# EAGLE design VehicleDriverSchematics2 (EAGLE 9.6.2)
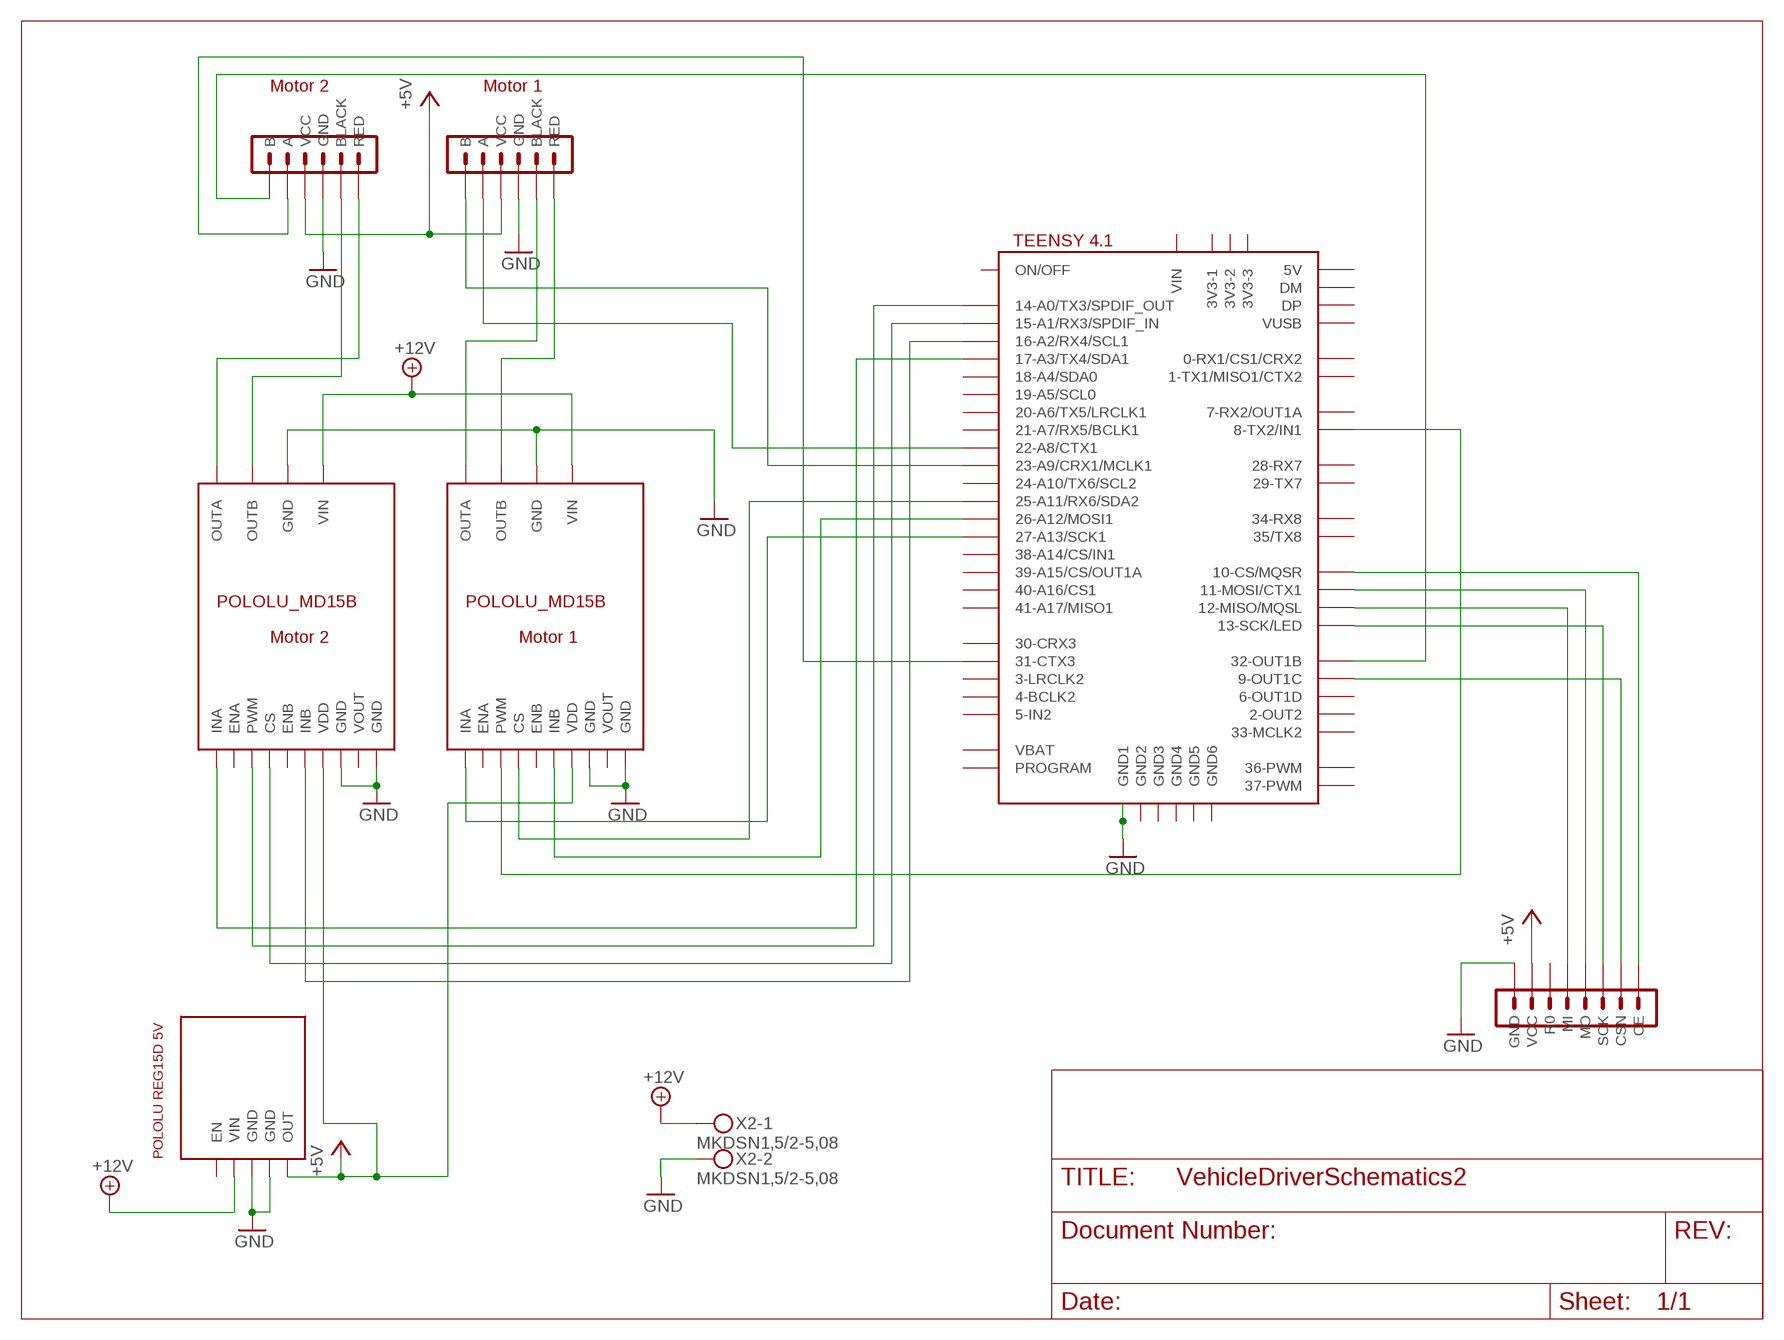
[diagram p0: schematic, sheet 1]

## Parts
U$2  POLOLU_MD15B  [POLOLU_MD15B]
U$3  POLOLU_MD15B  [POLOLU_MD15B]
U$4  TEENSY41-E  [TENNSY41-E]
U$5  MA06-1  [MA06-1]
U$6  MA06-1  [MA06-1]
U$7  MA08-1-RF24  [MA08-1-RF24]
U$8  POLOLU_REG15D  [POLOLU_REG15D]
X2  MKDSN1,5/2-5,08  [MKDSN1,5/2-5,08]

## Nets
+5V: U$2.VDD U$3.VDD U$5.VCC U$6.VCC U$7.VCC U$8.OUT
+12V: U$2.VIN U$3.VIN U$8.VIN X2.1
GND: U$2.GND U$2.GND@1(GND) U$2.GND@2(GND) U$3.GND U$3.GND@1(GND) U$3.GND@2(GND) U$4.GND1 U$5.GND U$6.GND U$7.GND U$8.GND U$8.GND@1(GND) X2.2
N$1: U$3.OUTB U$6.RED
N$2: U$3.OUTA U$6.BLACK
N$3: U$2.OUTA U$5.RED
N$4: U$2.OUTB U$5.BLACK
N$5: U$4.23-A9/CRX1/MCLK1 U$6.B
N$6: U$4.22-A8/CTX1 U$6.A
N$7: U$4.32-OUT1B U$5.B
N$8: U$4.31-CTX3 U$5.A
N$9: U$3.INA U$4.27-A13/SCK1
N$10: U$3.PWM U$4.8-TX2/IN1
N$11: U$3.CS U$4.25-A11/RX6/SDA2
N$12: U$3.INB U$4.26-A12/MOSI1
N$13: U$2.INA U$4.17-A3/TX4/SDA1
N$14: U$2.PWM U$4.14-A0/TX3/SPDIF_OUT
N$15: U$2.CS U$4.15-A1/RX3/SPDIF_IN
N$16: U$2.INB U$4.16-A2/RX4/SCL1
N$17: U$4.12-MISO/MQSL U$7.MI
N$18: U$4.11-MOSI/CTX1 U$7.MO
N$19: U$4.13-SCK/LED U$7.SCK
N$20: U$4.10-CS\MQSR(10-CS/MQSR) U$7.CE
N$21: U$4.9-OUT1C U$7.CSN
Unconnected: U$2.ENA U$2.ENB U$2.VOUT U$3.ENA U$3.ENB U$3.VOUT U$4.0-RX1/CS1/CRX2 U$4.1-TX1/MISO1/CTX2 U$4.2-OUT2 U$4.3-LRCLK2 U$4.3V3-1 U$4.3V3-2 U$4.3V3-3 U$4.4-BCLK2 U$4.5-IN2 U$4.6-OUT1D U$4.7-RX2/OUT1A U$4.18-A4/SDA0 U$4.19-A5/SCL0 U$4.20-A6/TX5/LRCLK1 U$4.21-A7/RX5/BCLK1 U$4.24-A10/TX6/SCL2 U$4.28-RX7 U$4.29-TX7 U$4.30-CRX3 U$4.33-MCLK2 U$4.34-RX8 U$4.35-TX8(35/TX8) U$4.36-PWM U$4.37-PWM U$4.38-A14/CS/IN1 U$4.39-A15/CS/OUT1A U$4.40-A16/CS1 U$4.41-A17/MISO1 U$4.+5V(5V) U$4.DM U$4.DP U$4.GND2 U$4.GND3 U$4.GND4 U$4.GND5 U$4.GND6 U$4.ON/OFF U$4.PROGRAM U$4.VBAT U$4.VIN U$4.VUSB U$7.R0 U$8.EN

## Notes on the sheet
- Motor 2 | Motor 1
- Motor 2 | Motor 1

## Library data of the parts
U$2 U$3 = VehicleDriverParts:POLOLU_MD15B
U$4 = teensy:TEENSY41-E
U$5 U$6 = VehicleDriverParts:MA06-1
U$7 = VehicleDriverParts:MA08-1-RF24
U$8 = VehicleDriverParts:POLOLU_REG15D
X2 = con-phoenix-508:MKDSN1,5/2-5,08: MKDSN 1,5/ 2-5,08 Printklemme Nennstrom: 13,5 A Nennspannung: 250 V Rastermaß: 5,08 mm Polzahl: 2 Anschlussart: Schraubanschluss Montage: Löten Anschlussrichtung Leiter/Platine: 0 ° Artikelnummer: 1729128 Source: http://eshop.phoenixcontact.com .. 1729128.pdf

## Board
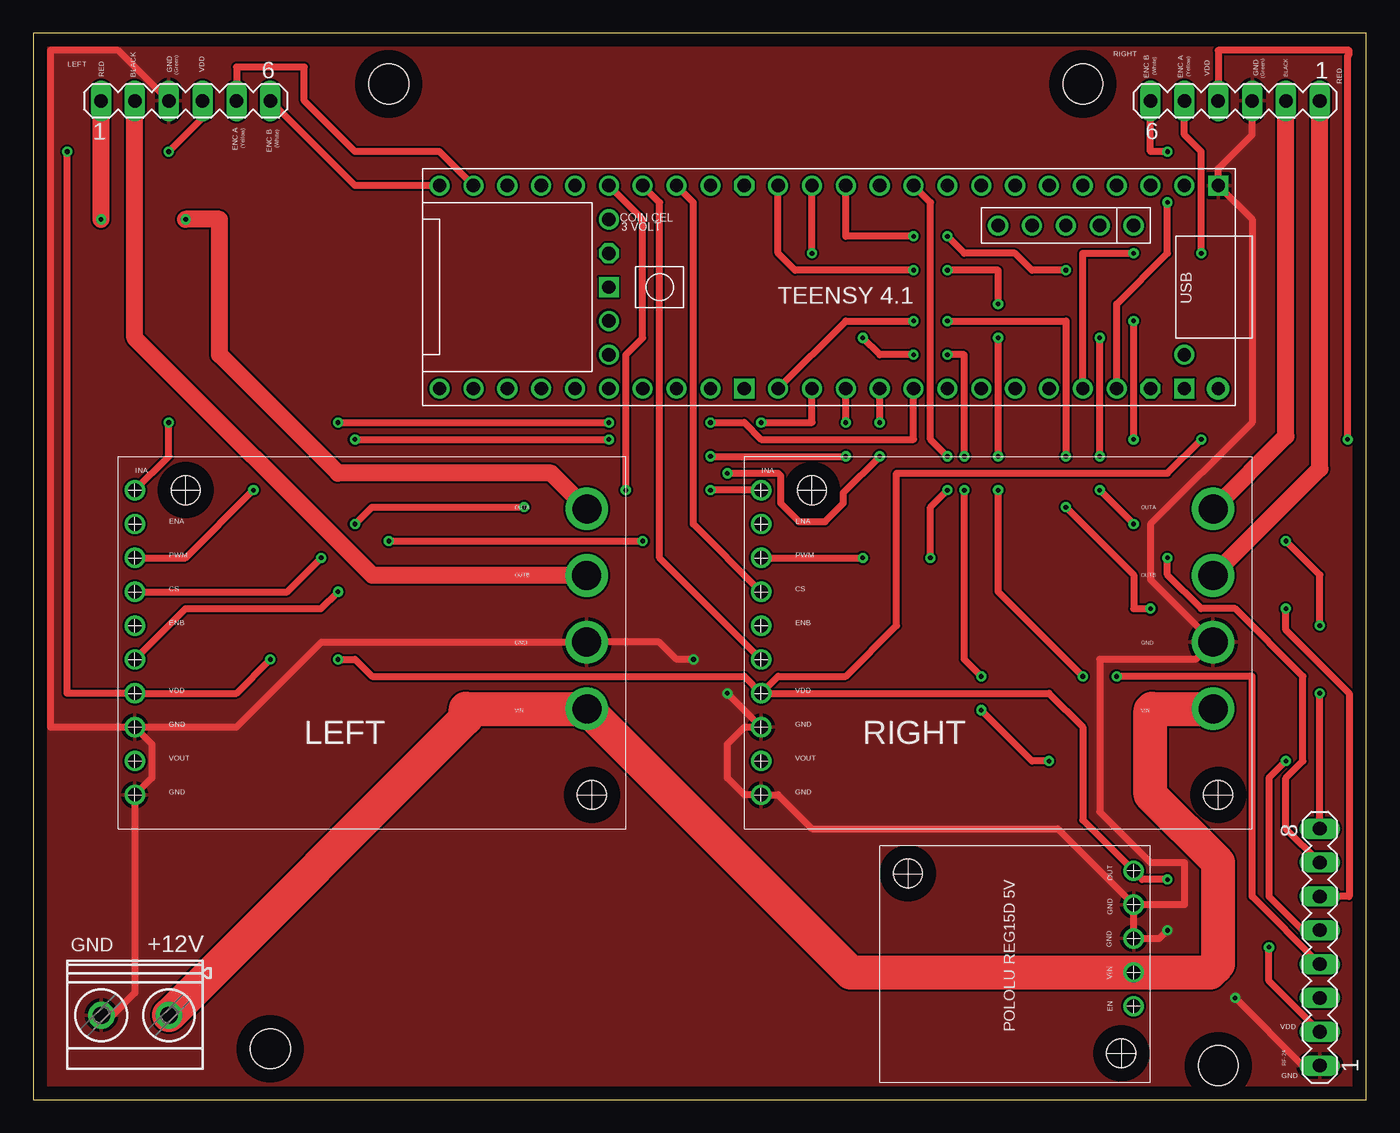
[diagram p1: board, top side]
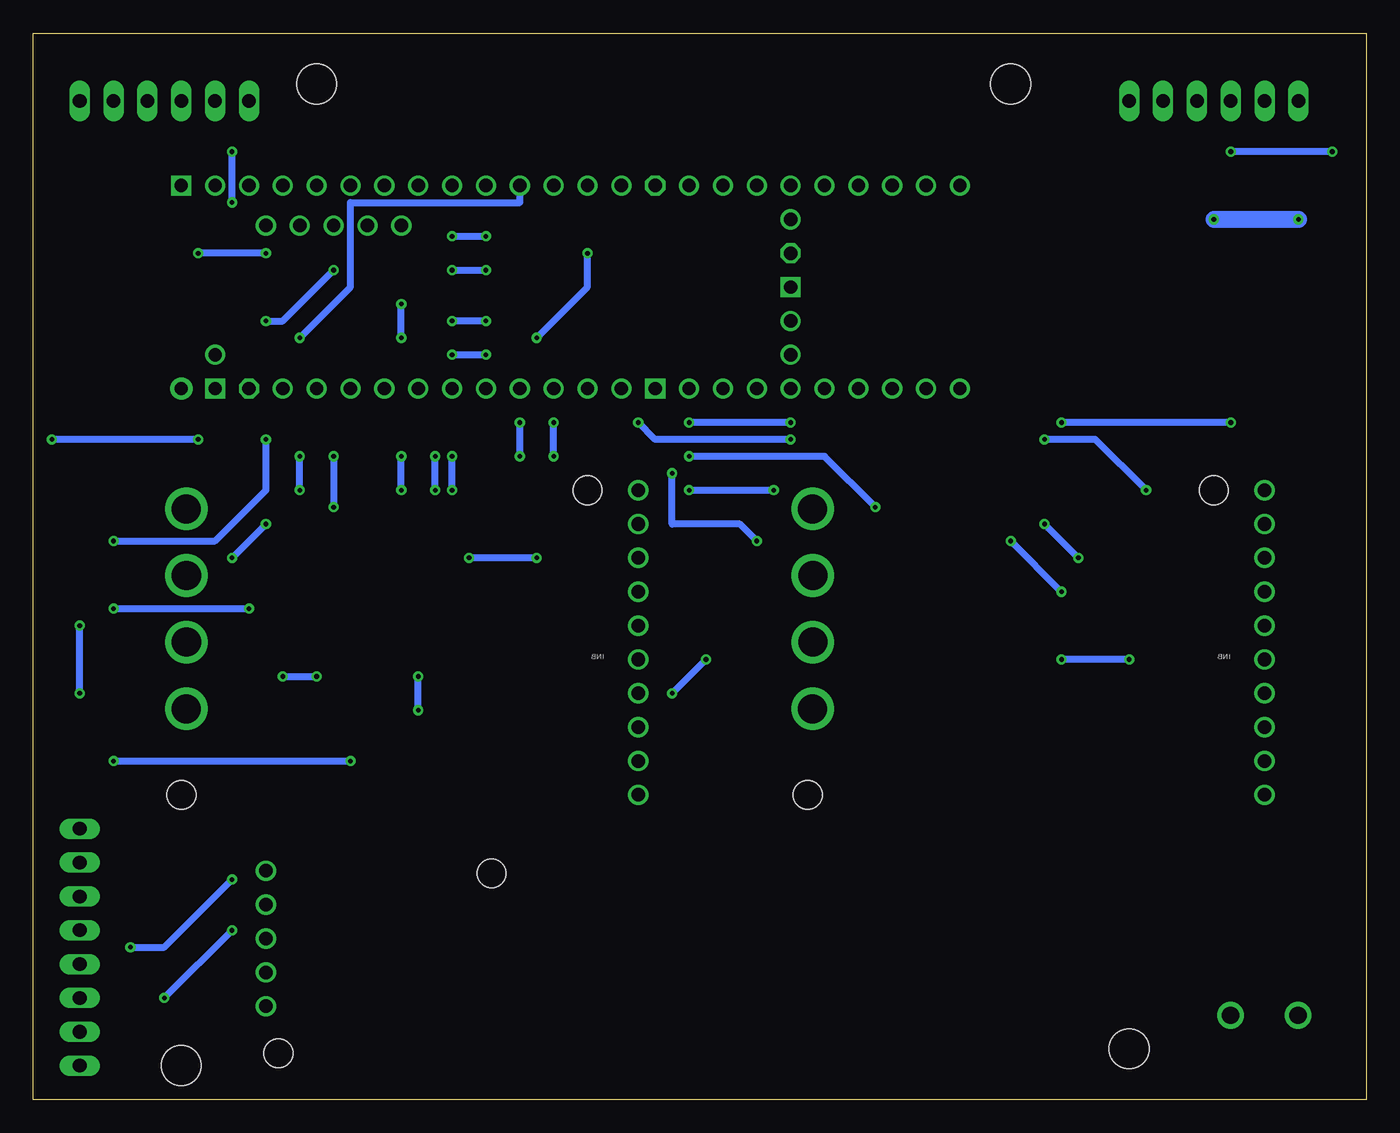
[diagram p2: board, bottom side, seen from below]

Size 100 x 80 mm. Coordinates in mm from the lower left corner, seen from the top.
Outline: 0,0 100,0 100,80 0,80 0,0
Copper layers (1*16): Top 0.035mm / dielectric 1.5mm / Bottom 0.035mm
Design rules "default": minimum track width 6mil, minimum drill 0.35mm, track to track 6mil, track to pad 6mil, pad to pad 6mil, via to via 6mil, smd to smd 6mil, copper to edge 40mil, drill to drill 6mil, minimum pad ring 10mil, minimum via ring 8mil, stop-mask expansion 4mil, vias tented up to drill 0mil, thermal gap 10mil
Holes 3 mm at 26.67,76.2 78.74,76.2 17.78,3.81 88.9,2.54

### Footprints (pad centres in the part's own frame; a part is rotated, then mirrored left to right if it is on the bottom)
POLOLU_MD15B = drill 1.016: CS 1.27,17.78; ENA 1.27,22.86; ENB 1.27,15.24; GND 1.27,7.62; GND@1 1.27,2.54; INA 1.27,25.4; INB 1.27,12.7; PWM 1.27,20.32; VDD 1.27,10.16; VOUT 1.27,5.08 | drill 2.18: GND@2 35.17,14; OUTA 35.18,24; OUTB 35.17,19; VIN 35.18,9 | hole 2.18: 5.08,25.4; 35.56,2.54
TENNSY41-E = drill 1: 0-RX1/CS1/CRX2 -27.94,-7.62; 1-TX1/MISO1/CTX2 -25.4,-7.62; 2-OUT2 -22.86,-7.62; 3-LRCLK2 -20.32,-7.62; 4-BCLK2 -17.78,-7.62; 5-IN2 -15.24,-7.62; 6-OUT1D -12.7,-7.62; 7-RX2/OUT1A -10.16,-7.62; 8-TX2/IN1 -7.62,-7.62; 9-OUT1C -5.08,-7.62; 10-CS\MQSR -2.54,-7.62; 11-MOSI/CTX1 0,-7.62; 12-MISO/MQSL 2.54,-7.62; 13-SCK/LED 2.54,7.62; 14-A0/TX3/SPDIF_OUT 0,7.62; 15-A1/RX3/SPDIF_IN -2.54,7.62; 16-A2/RX4/SCL1 -5.08,7.62; 17-A3/TX4/SDA1 -7.62,7.62; 18-A4/SDA0 -10.16,7.62; 19-A5/SCL0 -12.7,7.62; 20-A6/TX5/LRCLK1 -15.24,7.62; 21-A7/RX5/BCLK1 -17.78,7.62; 22-A8/CTX1 -20.32,7.62; 23-A9/CRX1/MCLK1 -22.86,7.62; 24-A10/TX6/SCL2 7.62,-7.62; 25-A11/RX6/SDA2 10.16,-7.62; 26-A12/MOSI1 12.7,-7.62; 27-A13/SCK1 15.24,-7.62; 28-RX7 17.78,-7.62; 29-TX7 20.32,-7.62; 30-CRX3 22.86,-7.62; 31-CTX3 25.4,-7.62; 32-OUT1B 27.94,-7.62; 33-MCLK2 27.94,7.62; 34-RX8 25.4,7.62; 35-TX8 22.86,7.62; 36-PWM 20.32,7.62; 37-PWM 17.78,7.62; 38-A14/CS/IN1 15.24,7.62; 39-A15/CS/OUT1A 12.7,7.62; 40-A16/CS1 10.16,7.62; 41-A17/MISO1 7.62,7.62; +5V -24.13,-4.62; DM -21.59,-4.62; DP -19.05,-4.62; GND4 -16.51,-4.62; GND5 -13.97,-4.62; ON/OFF 15.24,5.08; PROGRAM 15.24,2.54; VBAT 15.24,-5.08; VUSB -27.94,5.08 | drill 1 octagon: 3V3-1 5.08,-7.62; 3V3-2 15.24,-2.54; 3V3-3 -25.4,7.62 | drill 1 square: GND1 -30.48,-7.62; GND2 15.24,0; GND3 5.08,7.62; GND6 -27.94,7.62 | drill 1 pad 1.676: VIN -30.48,7.62
MA06-1 = drill 1.016 long: A 3.81,0; B 6.35,0; BLACK -3.81,0; GND -1.27,0; RED -6.35,0; VCC 1.27,0
MA08-1-RF24 = drill 1.016 long: CE 8.89,0; CSN 6.35,0; GND -8.89,0; MI -1.27,0; MO 1.27,0; R0 -3.81,0; SCK 3.81,0; VCC -6.35,0
POLOLU_REG15D = drill 1.016: EN 5.73,1.27; GND 13.35,1.27; GND@1 10.81,1.27; OUT 15.89,1.27; VIN 8.27,1.27 | hole 2.18: 2.2,2.2; 15.7,18.2
MKDSN1,5/2-5,08 = drill 1.3 pad 2: 1 -2.561,0.025; 2 2.519,0.025

### Placement (x,y rotation side)
U$2  6.35,20.32 0 top
U$3  53.34,20.32 0 top
U$4  58.42,60.96 180 top
U$5  11.43,74.93 0 top
U$6  90.17,74.93 180 top
U$7  96.52,11.43 90 top
U$8  83.82,1.27 90 top
X2  7.62,6.35 180 top

### Tracks (layer width: path | path; a pad name or v marks a point on that pad's centre or on a via)
+5V  (via drill 0.35)
  Top 0.508: v2.54,71.12 2.54,30.48 U$2.VDD 15.24,30.48 v17.78,33.02 | v10.16,71.12 12.7,73.66 U$5.VCC | v22.86,33.02 24.13,33.02 25.4,31.75 53.34,31.75 U$3.VDD | U$3.VDD 76.2,30.48 78.74,27.94 78.74,20.97 U$8.OUT 83.2,16.51 v85.09,16.51 | U$3.VDD 55.88,31.75 60.96,31.75 64.77,35.56 64.77,46.99 85.09,46.99 v87.63,49.53 | v98.61,49.53 98.61,78.29 98.73,78.41 98.73,78.73 88.9,78.73 U$6.VCC | U$7.VCC 92.71,8.89 v92.71,11.43
  Bottom 0.508: v2.54,71.12 v10.16,71.12 | v17.78,33.02 v22.86,33.02 | v87.63,49.53 v98.61,49.53 | v92.71,11.43 90.17,11.43 v85.09,16.51
+12V
  Top 2.54: U$3.VIN 83.93,29.32 83.82,29.21 83.82,22.86 88.9,17.78 88.9,10.16 88.28,9.54 U$8.VIN 61.31,9.54 U$2.VIN 32.44,29.32 32.44,28.58 X2.1
GND  (via drill 0.35)
  Top 0.508: U$5.GND 6.36,78.73 1.27,78.73 1.27,27.94 U$2.GND | U$8.GND U$8.GND@1 84.47,12.08 v85.09,12.7 | v90.17,7.62 95.25,2.54 U$7.GND | U$2.GND 8.89,26.67 8.89,24.13 U$2.GND@1 7.62,11.43 7.62,8 5.95,6.33 X2.2 | U$2.GND 15.24,27.94 21.62,34.32 U$2.GND@2 46.96,34.32 48.26,33.02 v49.53,33.02 | U$8.GND 76.85,20.32 58.42,20.32 55.88,22.86 U$3.GND@1 53.34,22.86 52.07,24.13 52.07,26.67 53.34,27.94 U$3.GND v52.07,30.48 | U$6.GND 91.44,72.39 88.9,69.85 U$4.GND1 91.44,66.04 91.44,50.8 83.82,43.18 83.82,39.01 U$3.GND@2 87.21,33.02 80.01,33.02 80.01,21.59 83.82,17.78 86.36,17.78 86.36,14.62 U$8.GND
  Bottom 0.508: v85.09,12.7 v90.17,7.62 | v52.07,30.48 v49.53,33.02
  pour Top: 0,80 0,0 100,0 100,80
N$1
  Top 1.27: U$3.OUTB 96.52,47.33 U$6.RED
N$2
  Top 1.27: U$3.OUTA 93.98,49.78 U$6.BLACK
N$3  (via drill 0.35)
  Top 1.27: U$2.OUTA 38.86,46.99 22.86,46.99 13.97,55.88 13.97,66.04 v11.43,66.04 | v5.08,66.04 U$5.RED
  Bottom 1.27: v11.43,66.04 v5.08,66.04
N$4
  Top 1.27: U$2.OUTB 25.45,39.32 7.62,57.15 U$5.BLACK
N$5  (via drill 0.35)
  Top 0.508: U$4.23-A9/CRX1/MCLK1 81.28,59.69 85.09,63.5 v85.09,67.31 | v85.09,71.12 83.82,71.12 U$6.B
  Bottom 0.508: v85.09,67.31 v85.09,71.12
N$6  (via drill 0.35)
  Top 0.508: U$4.22-A8/CTX1 78.74,63.5 v82.55,63.5 | v87.63,63.5 87.63,71.12 86.36,72.39 U$6.A
  Bottom 0.508: v82.55,63.5 v87.63,63.5
N$7
  Top 0.508: U$4.32-OUT1B 24.13,68.58 U$5.B
N$8
  Top 0.508: U$4.31-CTX3 30.48,71.12 24.13,71.12 20.32,74.93 20.32,77.47 15.24,77.47 U$5.A
N$9  (via drill 0.35)
  Top 0.508: U$3.INA v50.8,45.72 | v44.45,45.72 44.45,55.88 45.72,57.15 45.72,66.04 U$4.27-A13/SCK1
  Bottom 0.508: v50.8,45.72 v44.45,45.72
N$10  (via drill 0.35)
  Top 0.508: U$3.PWM v62.23,40.64 | v67.31,40.64 67.31,44.45 v68.58,45.72 | v68.58,48.26 67.31,49.53 67.31,67.31 U$4.8-TX2/IN1
  Bottom 0.508: v62.23,40.64 v67.31,40.64 | v68.58,45.72 v68.58,48.26
N$11
  Top 0.508: U$3.CS 49.53,43.18 49.53,67.31 U$4.25-A11/RX6/SDA2
N$12
  Top 0.508: U$3.INB 46.99,40.64 46.99,67.31 U$4.26-A12/MOSI1
N$13  (via drill 0.35)
  Top 0.508: U$2.INA 10.16,48.26 v10.16,50.8 | v22.86,50.8 v43.18,50.8 | v50.8,50.8 53.34,50.8 54.61,49.53 66.04,49.53 U$4.17-A3/TX4/SDA1
  Bottom 0.508: v10.16,50.8 v22.86,50.8 | v43.18,50.8 v50.8,50.8
N$14  (via drill 0.35)
  Top 0.508: U$2.PWM 11.43,40.64 v16.51,45.72 | v24.13,49.53 v43.18,49.53 | v54.61,50.8 58.42,50.8 U$4.14-A0/TX3/SPDIF_OUT
  Bottom 0.508: v16.51,45.72 20.32,49.53 v24.13,49.53 | v54.61,50.8 53.34,49.53 v43.18,49.53
N$15  (via drill 0.35)
  Top 0.508: U$2.CS 19.05,38.1 v21.59,40.64 | v24.13,43.18 25.4,44.45 v36.83,44.45 | v50.8,48.26 v60.96,48.26 | v60.96,50.8 U$4.15-A1/RX3/SPDIF_IN
  Bottom 0.508: v21.59,40.64 v24.13,43.18 | v36.83,44.45 40.64,48.26 v50.8,48.26 | v60.96,48.26 v60.96,50.8
N$16  (via drill 0.35)
  Top 0.508: U$2.INB 11.43,36.83 21.59,36.83 v22.86,38.1 | v26.67,41.91 v45.72,41.91 | v52.07,46.99 55.88,46.99 56.06,46.81 56.06,44.74 57.44,43.36 59.4,43.36 60.78,44.74 60.78,45.54 v63.5,48.26 | v63.5,50.8 U$4.16-A2/RX4/SCL1
  Bottom 0.508: v22.86,38.1 v26.67,41.91 | v45.72,41.91 46.99,43.18 52.07,43.18 v52.07,46.99 | v63.5,48.26 v63.5,50.8
N$17  (via drill 0.35)
  Top 0.508: U$7.MI 91.44,15.24 91.44,31.75 v81.28,31.75 | v78.74,31.75 72.39,38.1 v72.39,45.72 | v72.39,48.26 v72.39,57.15 | v72.39,59.69 72.39,62.23 v68.58,62.23 | v66.04,62.23 57.15,62.23 55.88,63.5 U$4.12-MISO/MQSL
  Bottom 0.508: v81.28,31.75 v78.74,31.75 | v72.39,45.72 v72.39,48.26 | v72.39,57.15 v72.39,59.69 | v68.58,62.23 v66.04,62.23
N$18  (via drill 0.35)
  Top 0.508: U$7.MO 95.25,12.7 92.71,15.24 92.71,24.13 v93.98,25.4 | v76.2,25.4 74.93,25.4 v71.12,29.21 | v71.12,31.75 69.85,33.02 v69.85,45.72 | v69.85,48.26 69.85,55.88 v68.58,55.88 | v66.04,55.88 63.5,55.88 v62.23,57.15 | v58.42,63.5 U$4.11-MOSI/CTX1
  Bottom 0.508: v93.98,25.4 v76.2,25.4 | v71.12,29.21 v71.12,31.75 | v69.85,45.72 v69.85,48.26 | v68.58,55.88 v66.04,55.88 | v62.23,57.15 58.42,60.96 v58.42,63.5
N$19  (via drill 0.35)
  Top 0.508: U$4.13-SCK/LED 60.96,58.42 v66.04,58.42 | v68.58,58.42 77.47,58.42 v77.47,48.26 | v77.47,44.45 82.55,39.37 82.55,36.83 v83.82,36.83 | U$7.SCK 98.73,15.24 98.73,30.48 93.98,35.23 v93.98,36.83
  Bottom 0.508: v66.04,58.42 v68.58,58.42 | v77.47,48.26 v77.47,44.45 | v93.98,36.83 v83.82,36.83
N$20  (via drill 0.35)
  Top 0.508: U$7.CE v96.52,30.48 | v96.52,35.56 96.52,39.37 v93.98,41.91 | v82.55,49.53 v82.55,58.42 | v77.47,62.23 74.93,62.23 73.66,63.5 69.85,63.5 v68.58,64.77 | v66.04,64.77 60.96,64.77 U$4.10-CS\MQSR
  Bottom 0.508: v96.52,30.48 v96.52,35.56 | v93.98,41.91 86.36,41.91 82.55,45.72 v82.55,49.53 | v82.55,58.42 81.28,58.42 v77.47,62.23 | v68.58,64.77 v66.04,64.77
N$21  (via drill 0.35)
  Top 0.508: U$7.CSN 93.98,20.32 93.98,24.13 95.25,25.4 95.25,31.75 90.17,36.83 87.63,36.83 85.09,39.37 v85.09,40.64 | v82.55,43.18 v80.01,45.72 | v80.01,48.26 v80.01,57.15
  Bottom 0.508: v85.09,40.64 v82.55,43.18 | v80.01,45.72 v80.01,48.26 | v80.01,57.15 76.2,60.96 76.2,67.31 63.5,67.31 U$4.9-OUT1C

### Text on the board
tNames: BLACK | RED | GND | (Green) | VDD | RIGHT | ENC B | (White) | ENC A | (Yellow) | VDD | GND | (Green) | BLACK | LEFT | RED | ENC A | (Yellow) | ENC B | (White) | LEFT | RIGHT | GND | +12V | VDD | GND